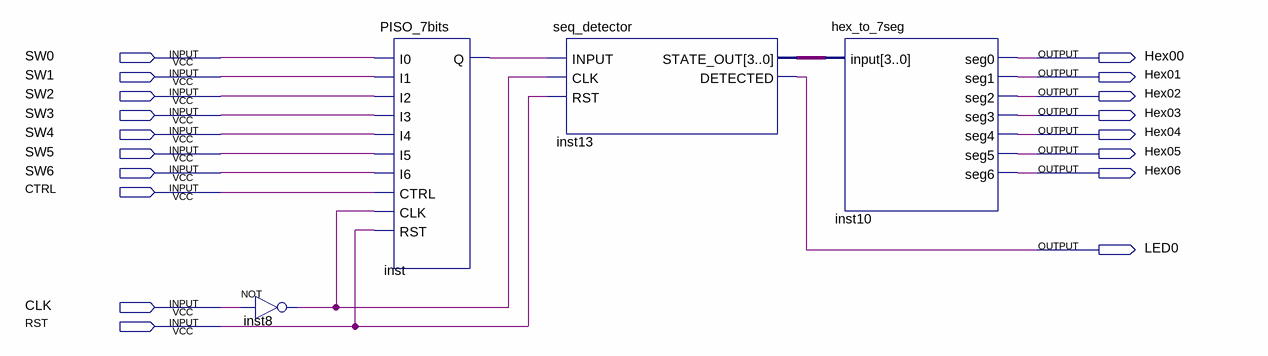
[diagram p0: schematic sheet]
// Quartus schematic lab006.bdf as structural Verilog: 4 symbols, 18 pins
module lab006 (
  input  SW0,
  input  SW1,
  input  SW2,
  input  SW3,
  input  SW4,
  input  SW5,
  input  SW6,
  input  CTRL,
  input  CLK,
  input  RST,
  output Hex00,
  output Hex01,
  output Hex02,
  output Hex03,
  output Hex04,
  output Hex05,
  output Hex06,
  output LED0
);

  wire inst8_out, inst_q;
  wire [3:0] inst13_state_out;

  not inst8 (inst8_out, CLK);
  PISO_7bits inst (
    .I0(SW0), .I1(SW1), .I2(SW2), .I3(SW3), .I4(SW4), .I5(SW5), .I6(SW6), .CTRL(CTRL), .CLK(inst8_out),
    .RST(RST), .Q(inst_q));
  seq_detector inst13 (.INPUT(inst_q), .CLK(inst8_out), .RST(RST), .STATE_OUT(inst13_state_out), .DETECTED(LED0));
  hex_to_7seg inst10 (
    .\input (inst13_state_out), .seg0(Hex00), .seg1(Hex01), .seg2(Hex02), .seg3(Hex03), .seg4(Hex04),
    .seg5(Hex05), .seg6(Hex06));
endmodule
